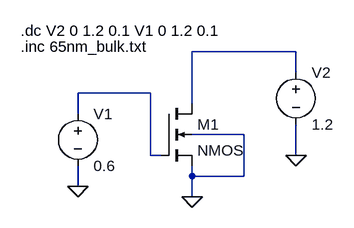
[diagram p0: schematic nmos_outputch1.asc]
nmos_outputch1.asc, the LTspice schematic file:
Version 4.1
SHEET 1 880 680
WIRE 336 64 176 64
WIRE 336 96 336 64
WIRE 112 128 0 128
WIRE 176 144 176 64
WIRE 0 160 0 128
WIRE 256 192 176 192
WIRE 112 224 112 128
WIRE 128 224 112 224
WIRE 336 224 336 176
WIRE 176 256 176 240
WIRE 256 256 256 192
WIRE 256 256 176 256
WIRE 0 272 0 240
WIRE 176 288 176 256
FLAG 0 272 0
FLAG 176 288 0
FLAG 336 224 0
SYMBOL nmos4 128 144 R0
SYMATTR InstName M1
SYMATTR Value2 l=100n w=1u
SYMBOL voltage 0 144 R0
WINDOW 123 0 0 Left 0
WINDOW 39 0 0 Left 0
SYMATTR InstName V1
SYMATTR Value 0.6
SYMBOL voltage 336 80 R0
WINDOW 123 0 0 Left 0
WINDOW 39 0 0 Left 0
SYMATTR InstName V2
SYMATTR Value 1.2
TEXT -88 32 Left 2 !.dc V2 0 1.2 0.1 V1 0 1.2 0.1
TEXT -88 56 Left 2 !.inc 65nm_bulk.txt

The netlist it stands for:
* nmos_outputch1.asc
M1 N001 N002 0 0 NMOS l=100n w=1u
V1 N002 0 0.6
V2 N001 0 1.2
.model NMOS NMOS
.model PMOS PMOS
.lib standard.mos
.dc V2 0 1.2 0.1 V1 0 1.2 0.1
.inc 65nm_bulk.txt
.backanno
.end